# Altium schematic sheet MCU.SchDoc: QUTMS Shutdown V2 - MCU
size A4; Author: Jonn Dillon; Organization: QUT Motorsport; Address1: O-120; Address2: O Block; Address3: QUT Gardens Point; Address4: Brisbane, 4000; DocumentNumber: 8; SheetNumber: 8; SheetTotal: 10
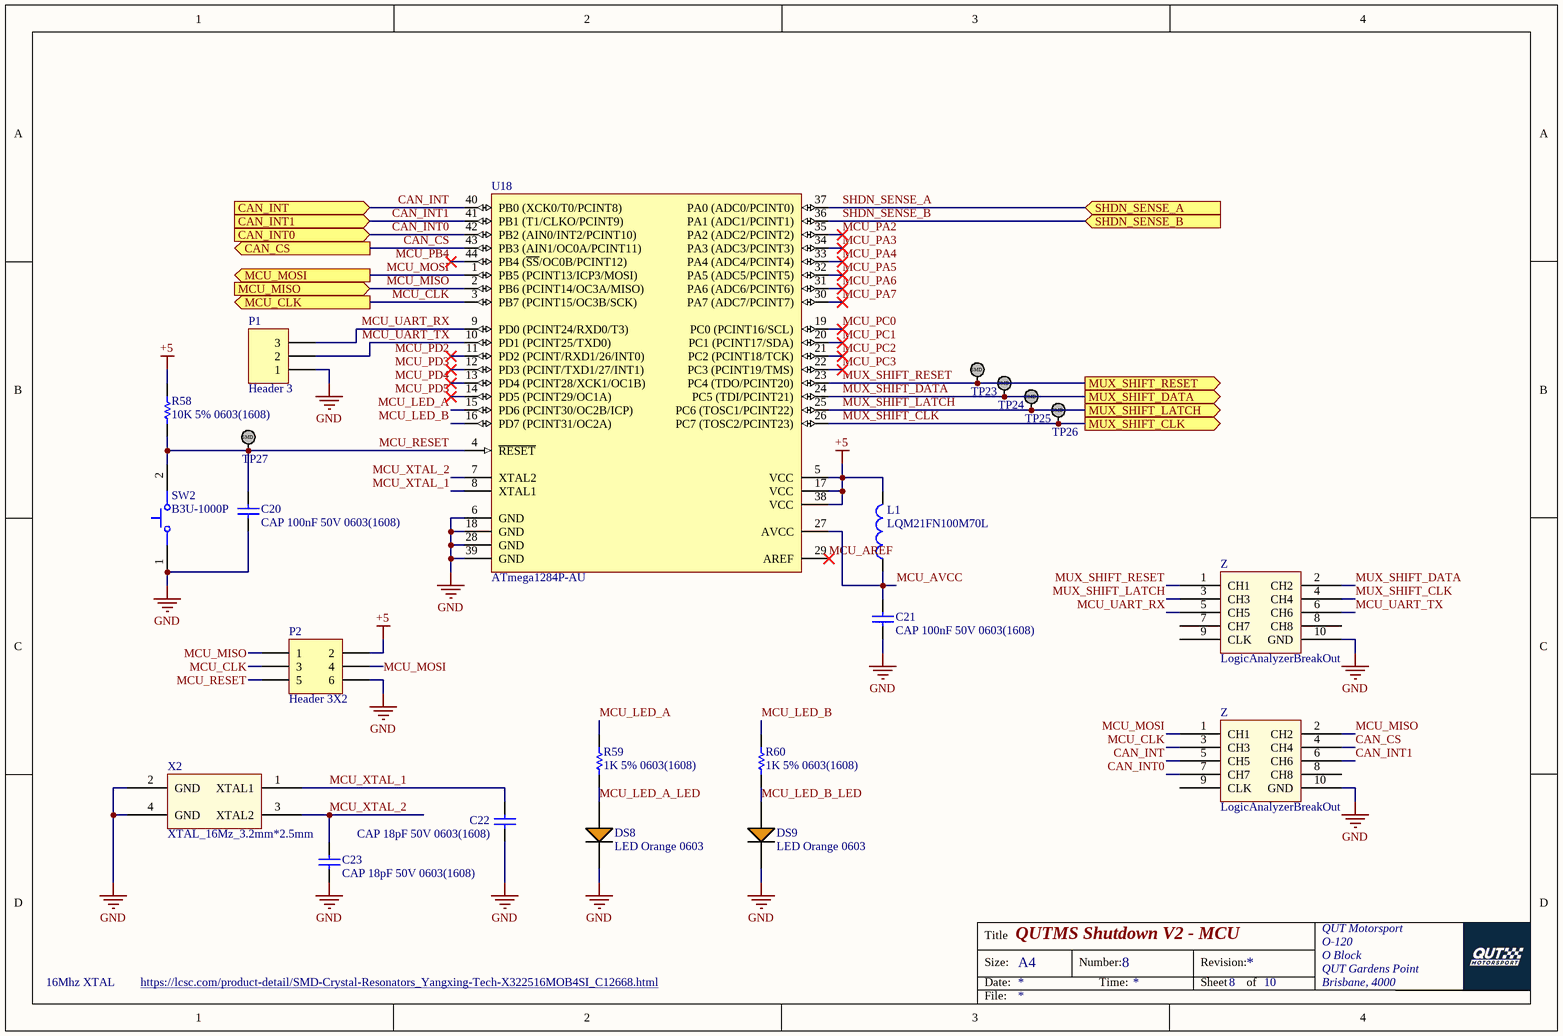
[diagram p0: MCU.SchDoc]

## Parts
(Parts that share a designator on the sheet are numbered #1, #2 ... from top to bottom, then left to right.)
C20  CAP 100nF 50V 0603(1608)  [CAPC0603(1608)100_L]
C21  CAP 100nF 50V 0603(1608)  [CAPC0603(1608)100_L]
C22  CAP 18pF 50V 0603(1608)  [CAPC0603(1608)100_L]
C23  CAP 18pF 50V 0603(1608)  [CAPC0603(1608)100_L]
DS8  LED Orange 0603  [LED ORANGE 0603]
DS9  LED Orange 0603  [LED ORANGE 0603]
L1  LQM21FN100M70L  [MURA-IND0805_L]
P1  Header 3  [HDR1X3]
P2  Header 3X2  [HDR2X3]
R58  10K 5% 0603(1608)  [RESC0603(1608)_N]
R59  1K 5% 0603(1608)  [RESC0603(1608)_L]
R60  1K 5% 0603(1608)  [RESC0603(1608)_L]
SW2  B3U-1000P  [OMRON-B3U-1000_V]
TP23  TestPoint_SMD  [TestPointSMD]  (value not drawn)
TP24  TestPoint_SMD  [TestPointSMD]  (value not drawn)
TP25  TestPoint_SMD  [TestPointSMD]  (value not drawn)
TP26  TestPoint_SMD  [TestPointSMD]  (value not drawn)
TP27  TestPoint_SMD  [TestPointSMD]  (value not drawn)
U18  ATmega1284P-AU  [44A_N]
X2  XTAL_16Mz_3.2mm*2.5mm  [3.2mm*2.5mm]
Z#1  LogicAnalyzerBreakOut  [LogicAnalyzer]
Z#2  LogicAnalyzerBreakOut  [LogicAnalyzer]

## Ports
CAN_CS (out), CAN_INT0 (in), CAN_INT1 (in), CAN_INT (in), MCU_CLK (out), MCU_MISO (in), MCU_MOSI (out), MUX_SHIFT_CLK (out), MUX_SHIFT_DATA (out), MUX_SHIFT_LATCH (out), MUX_SHIFT_RESET (out), SHDN_SENSE_A (in), SHDN_SENSE_B (in)

## Nets
+5: L1.2 P2.2 R58.2 U18.5(VCC) U18.17(VCC) U18.38(VCC)
GND: C20.2 C21.2 C22.1 C23.1 DS8.2(C) DS9.2(C) P1.1 P2.6 SW2.1 U18.6(GND) U18.18(GND) U18.28(GND) U18.39(GND) X2.2(GND) X2.4(GND) Z#1.10(GND) Z#2.10(GND)
CAN_CS: U18.43(PB3_(AIN1/OC0A/PCINT11)) Z#2.4(CH4) ; port CAN_CS
CAN_INT: U18.40(PB0_(XCK0/T0/PCINT8)) Z#2.5(CH5) ; port CAN_INT
CAN_INT0: U18.42(PB2_(AIN0/INT2/PCINT10)) Z#2.7(CH7) ; port CAN_INT0
CAN_INT1: U18.41(PB1_(T1/CLKO/PCINT9)) Z#2.6(CH6) ; port CAN_INT1
MCU_AREF: U18.29(AREF)
MCU_AVCC: C21.1 L1.1 U18.27(AVCC)
MCU_CLK: P2.3 U18.3(PB7_(PCINT15/OC3B/SCK)) Z#2.3(CH3) ; port MCU_CLK
MCU_LED_A: R59.2 U18.15(PD6_(PCINT30/OC2B/ICP))
MCU_LED_A_LED: DS8.1(A) R59.1
MCU_LED_B: R60.2 U18.16(PD7_(PCINT31/OC2A))
MCU_LED_B_LED: DS9.1(A) R60.1
MCU_MISO: P2.1 U18.2(PB6_(PCINT14/OC3A/MISO)) Z#2.2(CH2) ; port MCU_MISO
MCU_MOSI: P2.4 U18.1(PB5_(PCINT13/ICP3/MOSI)) Z#2.1(CH1) ; port MCU_MOSI
MCU_PA2: U18.35(PA2_(ADC2/PCINT2))
MCU_PA3: U18.34(PA3_(ADC3/PCINT3))
MCU_PA4: U18.33(PA4_(ADC4/PCINT4))
MCU_PA5: U18.32(PA5_(ADC5/PCINT5))
MCU_PA6: U18.31(PA6_(ADC6/PCINT6))
MCU_PA7: U18.30(PA7_(ADC7/PCINT7))
MCU_PB4: U18.44(PB4_(~{SS}/OC0B/PCINT12))
MCU_PC0: U18.19(PC0_(PCINT16/SCL))
MCU_PC1: U18.20(PC1_(PCINT17/SDA))
MCU_PC2: U18.21(PC2_(PCINT18/TCK))
MCU_PC3: U18.22(PC3_(PCINT19/TMS))
MCU_PD2: U18.11(PD2_(PCINT/RXD1/26/INT0))
MCU_PD3: U18.12(PD3_(PCINT/TXD1/27/INT1))
MCU_PD4: U18.13(PD4_(PCINT28/XCK1/OC1B))
MCU_PD5: U18.14(PD5_(PCINT29/OC1A))
MCU_RESET: C20.1 P2.5 R58.1 SW2.2 TP27.1 U18.4(~{RESET})
MCU_UART_RX: P1.3 U18.9(PD0_(PCINT24/RXD0/T3)) Z#1.5(CH5)
MCU_UART_TX: P1.2 U18.10(PD1_(PCINT25/TXD0)) Z#1.6(CH6)
MCU_XTAL_1: C22.2 U18.8(XTAL1) X2.1(XTAL1)
MCU_XTAL_2: C23.2 U18.7(XTAL2) X2.3(XTAL2)
MUX_SHIFT_CLK: TP26.1 U18.26(PC7_(TOSC2/PCINT23)) Z#1.4(CH4) ; port MUX_SHIFT_CLK
MUX_SHIFT_DATA: TP24.1 U18.24(PC5_(TDI/PCINT21)) Z#1.2(CH2) ; port MUX_SHIFT_DATA
MUX_SHIFT_LATCH: TP25.1 U18.25(PC6_(TOSC1/PCINT22)) Z#1.3(CH3) ; port MUX_SHIFT_LATCH
MUX_SHIFT_RESET: TP23.1 U18.23(PC4_(TDO/PCINT20)) Z#1.1(CH1) ; port MUX_SHIFT_RESET
SHDN_SENSE_A: U18.37(PA0_(ADC0/PCINT0)) ; port SHDN_SENSE_A
SHDN_SENSE_B: U18.36(PA1_(ADC1/PCINT1)) ; port SHDN_SENSE_B

Not connected (* = marked no-connect by the designer): Z#1 7(CH7) 8(CH8) 9(CLK); Z#2 8(CH8) 9(CLK)

## Notes on the sheet
- 16Mhz XTAL
- https://lcsc.com/product-detail/SMD-Crystal-Resonators_Yangxing-Tech-X322516MOB4SI_C12668.html
- Title
- Size:
- Date:
- A4
- Number:
- Time:
- Revision:
- Sheet
- of
- File:
- (in symbol TestPoint_SMD) SMD

## Library data of the parts
C20 C21 = CMP-1035-02591-1: CAP 100nF 50V ±5% 0603 (1608 Metric) Thickness 1mm SMD; Tolerance: Â±5%; Case-Metric: 1608; Case-EIA: 0603; Rated Voltage: 50 V; Max Thickness: 1 mm; Technology: SMT; Value: 100nF
C22 C23 = CMP-1035-00748-1: CAP 18pF 50V ±1% 0603 (1608 Metric) Thickness 1mm SMD; Case-EIA: 0603; Case-Metric: 1608; Tolerance: Â±1%; Max Thickness: 1 mm; Value: 18pF; Rated Voltage: 50 V; Technology: SMT
L1 = CMP-2000-06587-1: Fixed Inductor, 10 uH, +/-20%, -55 to 125 degC, 2-Pin SMD (0805), RoHS, Tape and Reel; Manufacturer: Murata; Tolerance (%): 20%; DC Resistance: 0.6; Inductance-Nom: 10H; Rated Current-Max: 100mA; Package Reference: IND0805; Case Size/Dimension: 0805; Manufacturer URL: http://www.murata.com/; Package Description: 2-Pin Surface Mount Device, Body 2 x 1.25 mm; Datasheet URL: http://psearch.en.murata.com/inductor/product/LQM21FN100M70%23.pdf; Mounting Technology: SurfaceMount; Datasheet Version: 05/2016
P1 = Header 3: Header, 3-Pin; LatestRevisionDate: 17-Jul-2002; LatestRevisionNote: Re-released for DXP Platform.; Publisher: Altium Limited
P2 = Header 3X2: Header, 3-Pin, Dual row; LatestRevisionDate: 17-Jul-2002; LatestRevisionNote: Re-released for DXP Platform.; Publisher: Altium Limited
R58 = CMP-1012-00098-1: 10K 0.1W 5% 0603 (1608 Metric)  SMD; Case-EIA: 0603; Value: 10000.00 Ohm; Case-Metric: 1608; Technology: SMT; Tolerance: 5 %; Power: 0.1 W
R59 R60 = CMP-1012-00074-1: 1K 0.1W 5% 0603 (1608 Metric)  SMD; Case-EIA: 0603; Case-Metric: 1608; Value: 1000.00 Ohm; Technology: SMT; Tolerance: 5 %; Power: 0.1 W
SW2 = CMP-2100-03586-1: Ultra-Small Tactile Switch, 0.05 A, 12 V, -25 to 70 degC, 2-Pin SMD, RoHS, Tape and Reel; Manufacturer: Omron Electronic Components; Operating Force: 1.5N; Current Rating: 50mA; Voltage Rating (DC): 12V; Electrical Life: 200000Cycles; Actuator Length: 0.4mm; Insulation Resistance: 100MOhm; Switch Travel: 0.15mm; Throw Configuration: SPST; Illumination Type: Illuminated; Width: 3mm; Weight: 0.022g; Datasheet Version: 42005.0; Datasheet URL: http://www.omron.com/ecb/products/pdf/en-b3u.pdf; Height: 1.2mm; Package Quantity: 1; REACH SVHC: Unknown; Contact Current Rating: 50mA; Contact Material: Silver; Max Current Rating: 50mA; Package Reference: B3U-1000; Termination: SMD/SMT; Packaging: TapeandReel; Manufacturer URL: http://www.omron.com/; RoHSCompliant: true; Mount: SurfaceMount; Length: 4mm; Min Operating Temperature: -25degC; Depth: 2.5mm; Lead Free: LeadFree; Case/Package: SMD/SMT; Package Description: 2-Pin Surface Mount Device, Body 3 x 2.5 mm; Max Operating Temperature: 70degC; Orientation: Straight
U18 = CMP-0095-00577-1: 8-bit AVR Microcontroller, 128KB Flash, 4KB EEPROM, 16KB SRAM, 44-pin TQFP, Industrial Grade (-40°C to 85°C); PackageReference: 44A; Code_JEDEC: MS-026-ACB; ComponentLink3Description: ATmega164A/164PA/324A/324PA/644A/644PA/1284/1284P Summary; DatasheetVersion: revC, Jun-2011; PackageDescription: 44-Pin Plastic Thin Profile Quad Flat Pack, 10 x 10 x 1.0 mm Body, 0.8 mm Pitch (TQFP); ComponentLink3URL: http://www.atmel.com/dyn/resources/prod_documents/8272S.pdf; ComponentLink1URL: http://www.atmel.com/; ComponentLink1Description: Manufacturer URL; ComponentLink2Description: ATmega164A/164PA/324A/324PA/644A/644PA/1284/1284P Datasheet; ComponentLink2URL: http://www.atmel.com/dyn/resources/prod_documents/doc8272.pdf; PackageVersion: revC, Oct-2010
Z#1 Z#2 = LogicAnalyer
  Z#1: ComponentLink1Description: LCSC; ComponentLink1URL: https://lcsc.com/product-detail/IDC-Connectors_BOOMELE-Boom-Precision-Elec-C5665_C5665.html
X2 = XTAL_16Mz_3.2mm*2.5mm: ComponentLink1Description: LCSC; ComponentLink1URL: https://lcsc.com/product-detail/SMD-Crystal-Resonators_Yangxing-Tech-X322516MOB4SI_C12668.html